# Altium schematic sheet USB 5V.SchDoc
size A4; SheetNumber: 3; SheetTotal: 6
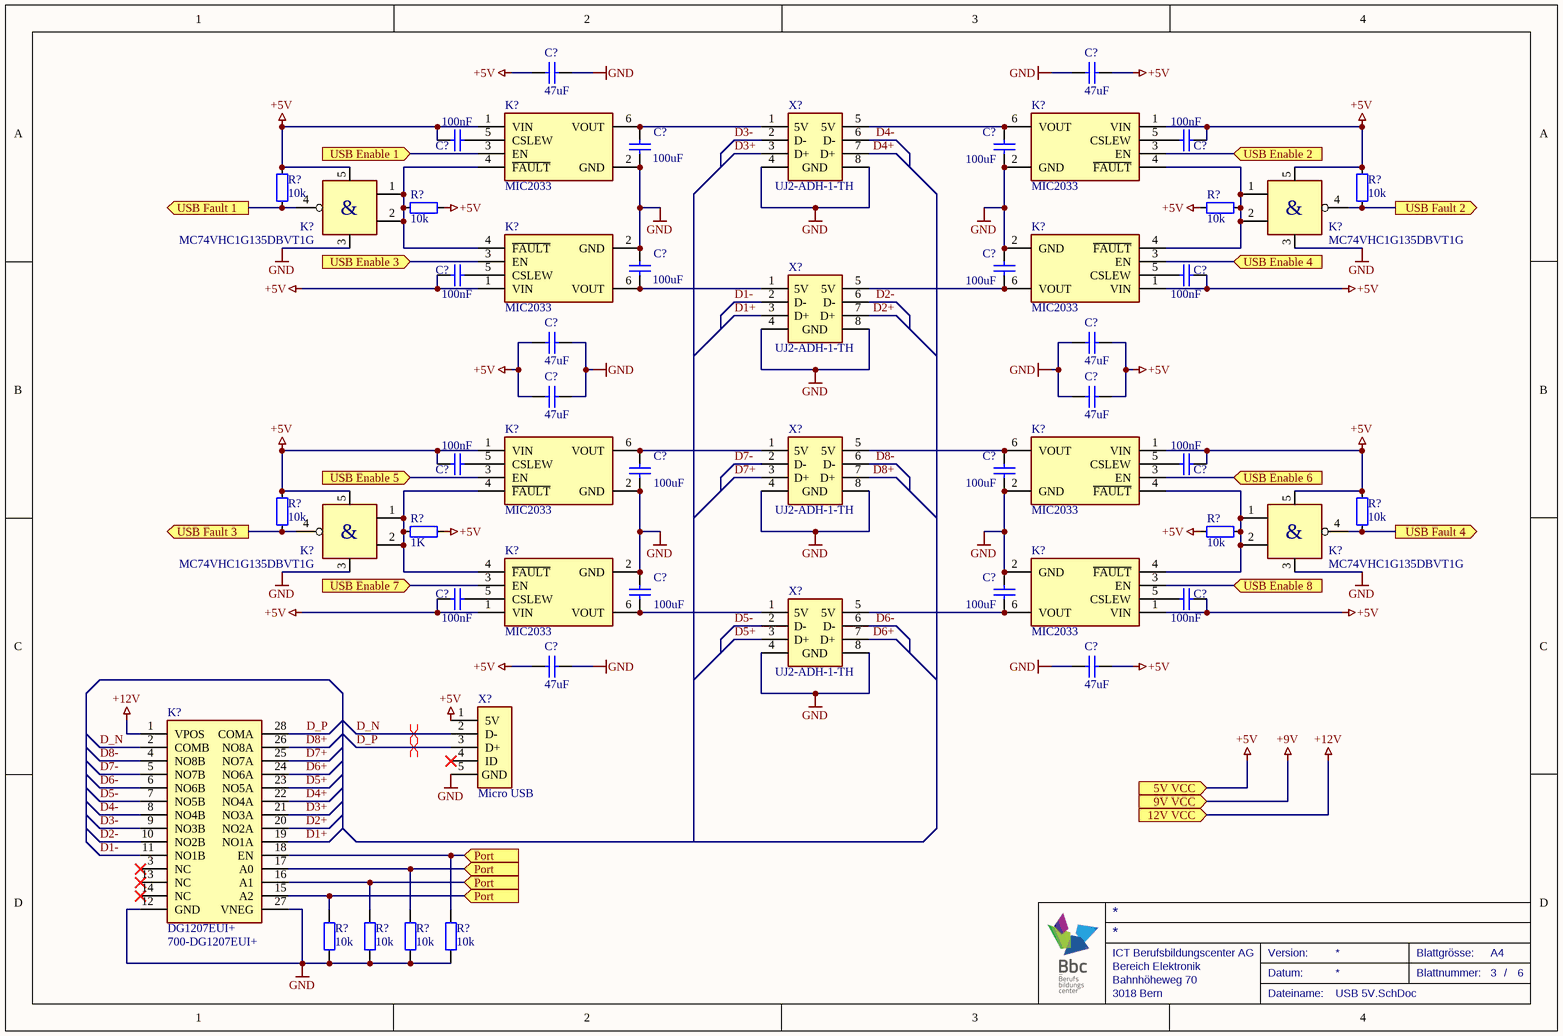
[diagram p0: USB 5V.SchDoc]

## Parts
(Parts that share a designator on the sheet are numbered #1, #2 ... from top to bottom, then left to right.)
C?#1  value 47uF  [CAP CER 0402 R]  (hidden comment: Capacitor)
C?#2  value 47uF  [CAP CER 0402 R]  (hidden comment: Capacitor)
C?#3  value 100nF  [CAP CER 0402 R]  (hidden comment: Capacitor)
C?#4  value 100nF  [CAP CER 0402 R]  (hidden comment: Capacitor)
C?#5  value 100uF  [CAP CER 0402 R]  (hidden comment: Capacitor)
C?#6  value 100uF  [CAP CER 0402 R]  (hidden comment: Capacitor)
C?#7  value 100nF  [CAP CER 0402 R]  (hidden comment: Capacitor)
C?#8  value 100uF  [CAP CER 0402 R]  (hidden comment: Capacitor)
C?#9  value 100uF  [CAP CER 0402 R]  (hidden comment: Capacitor)
C?#10  value 100nF  [CAP CER 0402 R]  (hidden comment: Capacitor)
C?#11  value 47uF  [CAP CER 0402 R]  (hidden comment: Capacitor)
C?#12  value 47uF  [CAP CER 0402 R]  (hidden comment: Capacitor)
C?#13  value 47uF  [CAP CER 0402 R]  (hidden comment: Capacitor)
C?#14  value 47uF  [CAP CER 0402 R]  (hidden comment: Capacitor)
C?#15  value 100nF  [CAP CER 0402 R]  (hidden comment: Capacitor)
C?#16  value 100nF  [CAP CER 0402 R]  (hidden comment: Capacitor)
C?#17  value 100uF  [CAP CER 0402 R]  (hidden comment: Capacitor)
C?#18  value 100uF  [CAP CER 0402 R]  (hidden comment: Capacitor)
C?#19  value 100nF  [CAP CER 0402 R]  (hidden comment: Capacitor)
C?#20  value 100uF  [CAP CER 0402 R]  (hidden comment: Capacitor)
C?#21  value 100uF  [CAP CER 0402 R]  (hidden comment: Capacitor)
C?#22  value 100nF  [CAP CER 0402 R]  (hidden comment: Capacitor)
C?#23  value 47uF  [CAP CER 0402 R]  (hidden comment: Capacitor)
C?#24  value 47uF  [CAP CER 0402 R]  (hidden comment: Capacitor)
K?#1  MIC2033
K?#2  MIC2033
K?#3  MC74VHC1G135DBVT1G
K?#4  MC74VHC1G135DBVT1G
K?#5  MIC2033
K?#6  MIC2033
K?#7  MIC2033
K?#8  MIC2033
K?#9  MC74VHC1G135DBVT1G
K?#10  MC74VHC1G135DBVT1G
K?#11  MIC2033
K?#12  MIC2033
K?#13  DG1207EUI+  Supplier Part Number 1: 700-DG1207EUI+  [SOP65P640X110-28N]
R?#1  value 10k  [RES 0402 R]  (hidden comment: Resistor)
R?#2  value 10k  [RES 0402 R]  (hidden comment: Resistor)
R?#3  value 10k  [RES 0402 R]  (hidden comment: Resistor)
R?#4  value 10k  [RES 0402 R]  (hidden comment: Resistor)
R?#5  value 10k  [RES 0402 R]  (hidden comment: Resistor)
R?#6  value 10k  [RES 0402 R]  (hidden comment: Resistor)
R?#7  value 1K  [RES 0402 R]  (hidden comment: Resistor)
R?#8  value 10k  [RES 0402 R]  (hidden comment: Resistor)
R?#9  value 10k  [RES 0402 R]  (hidden comment: Resistor)
R?#10  value 10k  [RES 0402 R]  (hidden comment: Resistor)
R?#11  value 10k  [RES 0402 R]  (hidden comment: Resistor)
R?#12  value 10k  [RES 0402 R]  (hidden comment: Resistor)
X?#1  UJ2-ADH-1-TH  [UJ2-ADH-1-TH]
X?#2  UJ2-ADH-1-TH  [UJ2-ADH-1-TH]
X?#3  UJ2-ADH-1-TH  [UJ2-ADH-1-TH]
X?#4  UJ2-ADH-1-TH  [UJ2-ADH-1-TH]
X?#5  Micro USB  [Header SMD Male 1x5 H]

## Ports
5V VCC (in), 9V VCC (in), 12V VCC (in), Port (in), USB Enable 1 (in), USB Enable 2 (in), USB Enable 3 (in), USB Enable 4 (in), USB Enable 5 (in), USB Enable 6 (in), USB Enable 7 (in), USB Enable 8 (in), USB Fault 1 (out), USB Fault 2 (out), USB Fault 3 (out), USB Fault 4 (out)

## Nets
+5V: C?#1.1 C?#2.2 C?#3.1 C?#4.1 C?#7.1 C?#10.1 C?#11.1 C?#12.2 C?#13.2 C?#14.1 C?#15.1 C?#16.1 C?#19.1 C?#22.1 C?#23.2 C?#24.1 K?#1.1(VIN) K?#2.1(VIN) K?#3.5(VCC) K?#4.5(VCC) K?#5.1(VIN) K?#6.1(VIN) K?#7.1(VIN) K?#8.1(VIN) K?#9.5(VCC) K?#10.5(VCC) K?#11.1(VIN) K?#12.1(VIN) R?#1.1 R?#2.1 R?#3.1 R?#4.1 R?#5.1 R?#6.1 R?#7.1 R?#8.1 X?#5.1(5V) ; port 5V VCC
+9V: port 9V VCC
+12V: K?#13.1(VPOS) ; port 12V VCC
GND: C?#1.2 C?#2.1 C?#5.1 C?#6.1 C?#8.2 C?#9.2 C?#11.2 C?#12.1 C?#13.1 C?#14.2 C?#17.1 C?#18.1 C?#20.2 C?#21.2 C?#23.1 C?#24.2 K?#1.2(GND) K?#2.2(GND) K?#3.3(GND) K?#4.3(GND) K?#5.2(GND) K?#6.2(GND) K?#7.2(GND) K?#8.2(GND) K?#9.3(GND) K?#10.3(GND) K?#11.2(GND) K?#12.2(GND) K?#13.12(GND) K?#13.27(VNEG) R?#9.1 R?#10.1 R?#11.1 R?#12.1 X?#1.4(GND) X?#1.8(GND) X?#2.4(GND) X?#2.8(GND) X?#3.4(GND) X?#3.8(GND) X?#4.4(GND) X?#4.8(GND) X?#5.5(GND)
D1+: K?#13.19(NO1A) X?#2.3(D+)
D1-: K?#13.11(NO1B) X?#2.2(D-)
D2+: K?#13.20(NO2A) X?#2.7(D+)
D2-: K?#13.10(NO2B) X?#2.6(D-)
D3+: K?#13.21(NO3A) X?#1.3(D+)
D3-: K?#13.9(NO3B) X?#1.2(D-)
D4+: K?#13.22(NO4A) X?#1.7(D+)
D4-: K?#13.8(NO4B) X?#1.6(D-)
D5+: K?#13.23(NO5A) X?#4.3(D+)
D5-: K?#13.7(NO5B) X?#4.2(D-)
D6+: K?#13.24(NO6A) X?#4.7(D+)
D6-: K?#13.6(NO6B) X?#4.6(D-)
D7+: K?#13.25(NO7A) X?#3.3(D+)
D7-: K?#13.5(NO7B) X?#3.2(D-)
D8+: K?#13.26(NO8A) X?#3.7(D+)
D8-: K?#13.4(NO8B) X?#3.6(D-)
D_N: K?#13.2(COMB) X?#5.2(D-)
D_P: K?#13.28(COMA) X?#5.3(D+)
Port: K?#13.15(A2) K?#13.16(A1) K?#13.17(A0) K?#13.18(EN) R?#9.2 R?#10.2 R?#11.2 R?#12.2 ; port Port
USB Enable 1: K?#1.3(EN) ; port USB Enable 1
USB Enable 2: K?#2.3(EN) ; port USB Enable 2
USB Enable 3: K?#5.3(EN) ; port USB Enable 3
USB Enable 4: K?#6.3(EN) ; port USB Enable 4
USB Enable 5: K?#7.3(EN) ; port USB Enable 5
USB Enable 6: K?#8.3(EN) ; port USB Enable 6
USB Enable 7: K?#11.3(EN) ; port USB Enable 7
USB Enable 8: K?#12.3(EN) ; port USB Enable 8
USB Fault 1: K?#3.4(Y) R?#1.2 ; port USB Fault 1
USB Fault 2: K?#4.4(Y) R?#2.2 ; port USB Fault 2
USB Fault 3: K?#9.4(Y) R?#5.2 ; port USB Fault 3
USB Fault 4: K?#10.4(Y) R?#6.2 ; port USB Fault 4
NetC?#3_2: C?#3.2 K?#1.5(CSLEW)
NetC?#4_2: C?#4.2 K?#2.5(CSLEW)
NetC?#5_2: C?#5.2 K?#1.6(VOUT) X?#1.1(5V)
NetC?#6_2: C?#6.2 K?#2.6(VOUT) X?#1.5(5V)
NetC?#7_2: C?#7.2 K?#5.5(CSLEW)
NetC?#8_1: C?#8.1 K?#5.6(VOUT) X?#2.1(5V)
NetC?#9_1: C?#9.1 K?#6.6(VOUT) X?#2.5(5V)
NetC?#10_2: C?#10.2 K?#6.5(CSLEW)
NetC?#15_2: C?#15.2 K?#7.5(CSLEW)
NetC?#16_2: C?#16.2 K?#8.5(CSLEW)
NetC?#17_2: C?#17.2 K?#7.6(VOUT) X?#3.1(5V)
NetC?#18_2: C?#18.2 K?#8.6(VOUT) X?#3.5(5V)
NetC?#19_2: C?#19.2 K?#11.5(CSLEW)
NetC?#20_1: C?#20.1 K?#11.6(VOUT) X?#4.1(5V)
NetC?#21_1: C?#21.1 K?#12.6(VOUT) X?#4.5(5V)
NetC?#22_2: C?#22.2 K?#12.5(CSLEW)
NetK?#1_4: K?#1.4(~{FAULT}) K?#3.1(A) K?#3.2(B) K?#5.4(~{FAULT}) R?#3.2
NetK?#2_4: K?#2.4(~{FAULT}) K?#4.1(A) K?#4.2(B) K?#6.4(~{FAULT}) R?#4.2
NetK?#7_4: K?#7.4(~{FAULT}) K?#9.1(A) K?#9.2(B) K?#11.4(~{FAULT}) R?#7.2
NetK?#8_4: K?#8.4(~{FAULT}) K?#10.1(A) K?#10.2(B) K?#12.4(~{FAULT}) R?#8.2

Not connected (* = marked no-connect by the designer): K?#13 3(NC)* 13(NC)* 14(NC)*; X?#5 4(ID)*

## Layout directives
differential pair: D_N, D_P

## Notes on the sheet
- Bahnhöheweg 70
- ICT Berufsbildungscenter AG
- Bereich Elektronik
- Datum:
- Version:
- Blattgrösse:
- Blattnummer:
- A4
- /
- 3018 Bern
- Dateiname:
- (in symbol MC74VHC1G135DBVT1G) &

## Library data of the parts
C?#1-C?#24 = Capacitor: Non polarized capacitor; LatestRevisionDate: 01.04.2019; Publisher: ICT Berufsbildungscenter AG
K?#13 = DG1207EUI+: Analog Switch ICs; Manufacturer_Name: Maxim Integrated; Datasheet Link: https://datasheets.maximintegrated.com/en/ds/DG1206-DG1207.pdf; Height: 1.1mm; Manufacturer_Part_Number: DG1207EUI+; Mouser Part Number: 700-DG1207EUI+; Mouser Price/Stock: https://www.mouser.co.uk/ProductDetail/Maxim-Integrated/DG1207EUI%2b?qs=DPoM0jnrROX2%252BoIpSyCc8Q%3D%3D; ComponentLink1Description: New link; ComponentLink1URL: https://www.mouser.ch/ProductDetail/Maxim-Integrated/DG1207EUI%2b?qs=DPoM0jnrROX2%252BoIpSyCc8Q%3D%3D; Supplier 1: Mouser
X?#1-X?#4 = UJ2-ADH-1-TH: USB Type A; Manufacturer_Name: CUI Inc.; Datasheet Link: http://www.cui.com/product/resource/uj2-adh-th.pdf; Manufacturer_Part_Number: UJ2-ADH-1-TH; Mouser Part Number: 490-UJ2-ADH-1-TH; Mouser Price/Stock: https://www.mouser.co.uk/ProductDetail/CUI-Devices/UJ2-ADH-1-TH/?qs=5mqXD9RfOg1bQeR60A16hA%3D%3D; Arrow Part Number: UJ2-ADH-1-TH; Arrow Price/Stock: https://www.arrow.com/en/products/uj2-adh-1-th/cui-devices
X?#5 = Micro USB: board to board header; LatestRevisionDate: 02.05.2019; Publisher: ICT Berufsbildungscenter AG
K?#1 K?#2 K?#5-K?#8 K?#11 K?#12 = MIC2033: ComponentLink1Description: New link; ComponentLink1URL: https://www.mouser.ch/ProductDetail/Microchip-Technology-Micrel/MIC2033-10AYM6-TR?qs=Y3Q3JoKAO1RvbLJdilrfXQ%3D%3D
R?#1-R?#12 = Resistor: LatestRevisionDate: 02.04.2019; Publisher: ICT Berufsbildungscenter AG